# EAGLE design mp3-trigger-v23 (EAGLE 5.11)

## Sheet 1 of 2
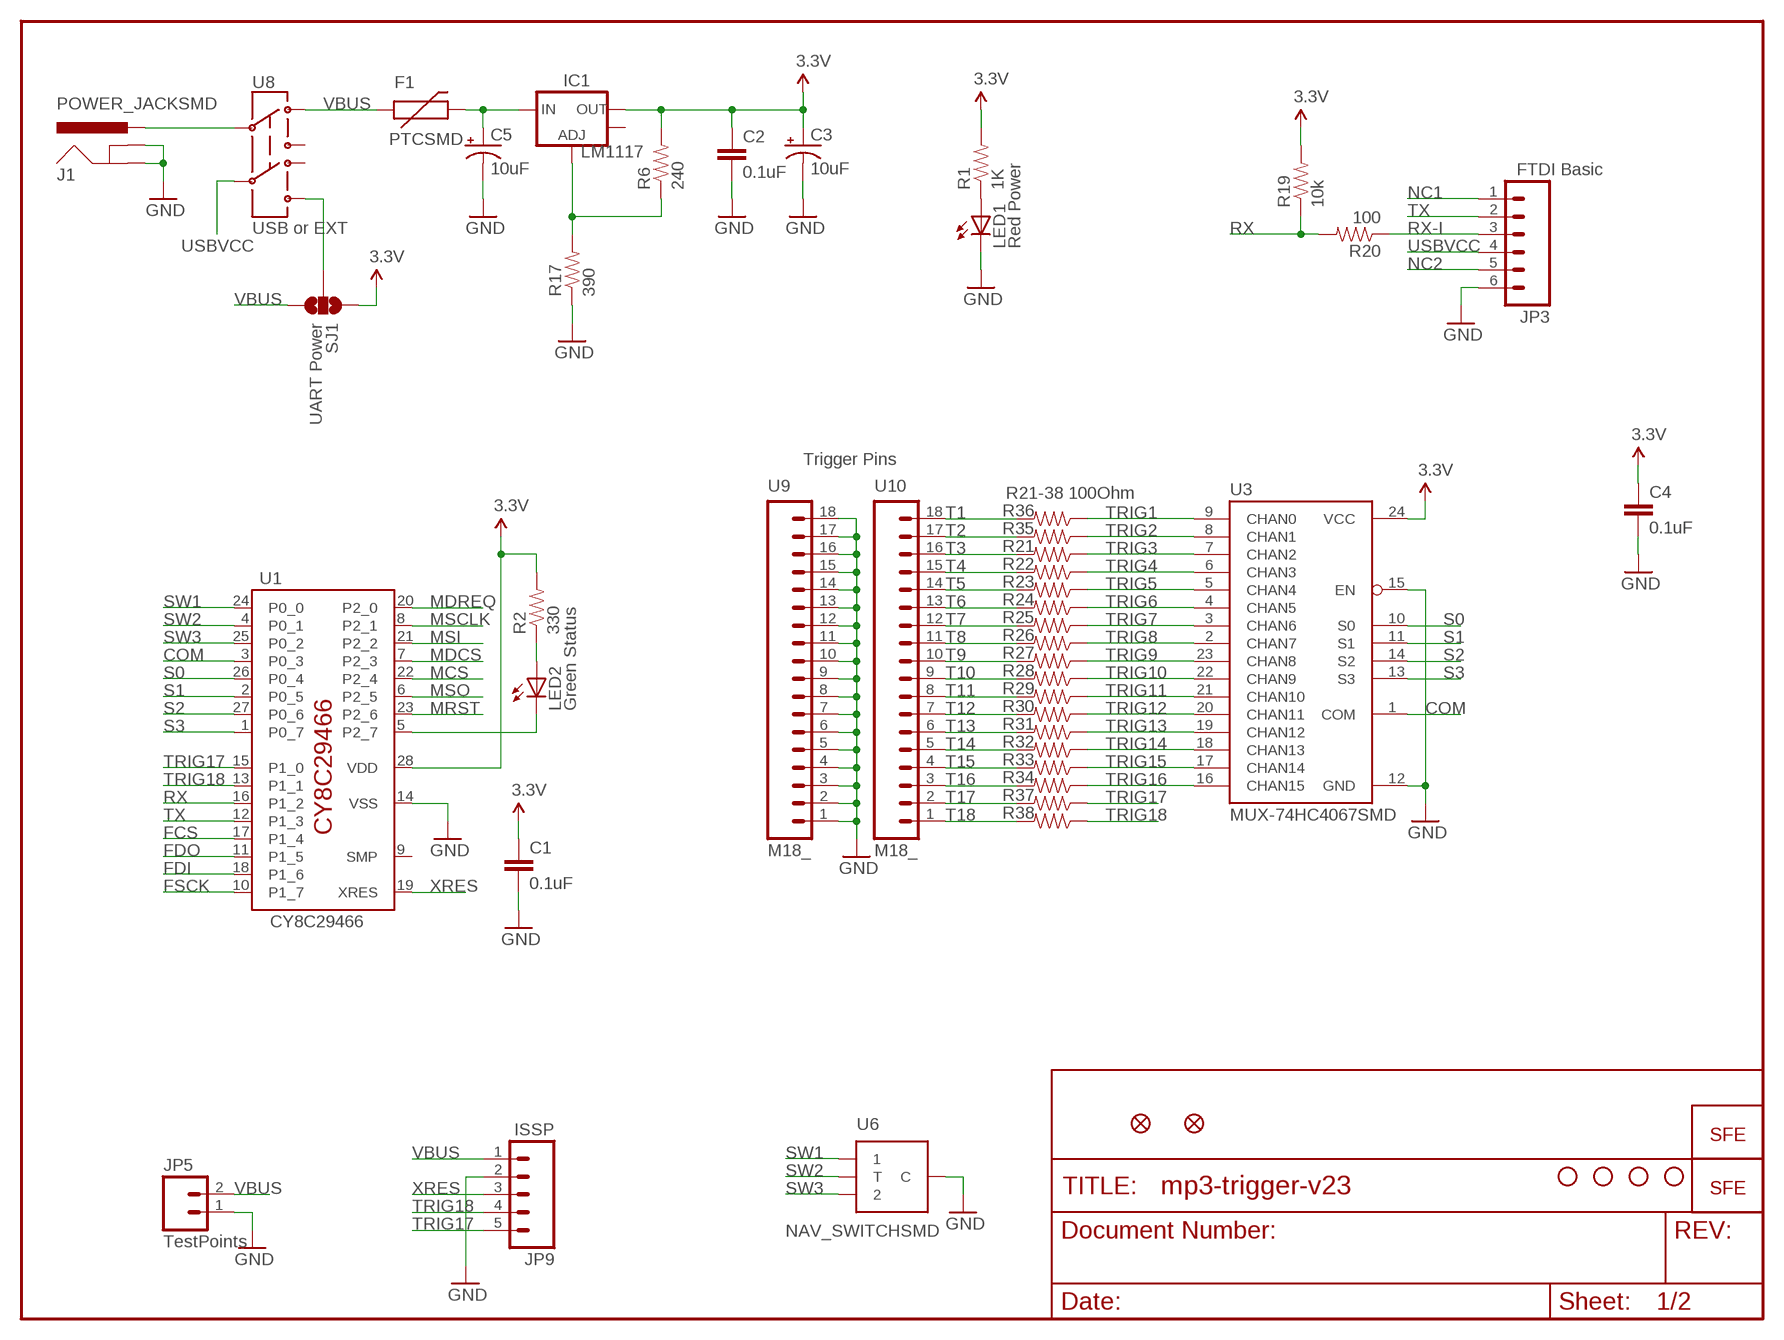
[diagram p0: schematic, sheet 1]

### Parts
C1  0.1uF  CAP0402-CAP  [0402-CAP]
C2  0.1uF  CAP0402-CAP  [0402-CAP]
C3  10uF  CAP_POL1206  [EIA3216]
C4  0.1uF  CAP0402-CAP  [0402-CAP]
C5  10uF  CAP_POL1206  [EIA3216]
F1  PTCSMD  [PTC-1206]
IC1  LM1117  V_REG_LM1117SOT223  [SOT223]
J1  POWER_JACKSMD  [POWER_JACK_SMD]
JP3  FTDI Basic  M06SIP  [1X06]
JP5  TestPoints  M02PTH  [1X02]
JP6  FIDUCIAL1X2  [FIDUCIAL-1X2]
JP7  FIDUCIAL1X2  [FIDUCIAL-1X2]
JP9  ISSP  M05PTH  [1X05]
LED1  Red Power  LED1206  [LED-1206]
LED2  Green Status  LED1206  [LED-1206]
R1  1K  RESISTOR0402-RES  [0402-RES]
R2  330  RESISTOR0402-RES  [0402-RES]
R6  240  RESISTOR0402-RES  [0402-RES]
R17  390  RESISTOR0402-RES  [0402-RES]
R19  10k  RESISTOR0402-RES  [0402-RES]
R20  100  RESISTOR0402-RES  [0402-RES]
R21  100  RESISTOR0402-RES  [0402-RES]
R22  100  RESISTOR0402-RES  [0402-RES]
R23  100  RESISTOR0402-RES  [0402-RES]
R24  100  RESISTOR0402-RES  [0402-RES]
R25  100  RESISTOR0402-RES  [0402-RES]
R26  100  RESISTOR0402-RES  [0402-RES]
R27  100  RESISTOR0402-RES  [0402-RES]
R28  100  RESISTOR0402-RES  [0402-RES]
R29  100  RESISTOR0402-RES  [0402-RES]
R30  100  RESISTOR0402-RES  [0402-RES]
R31  100  RESISTOR0402-RES  [0402-RES]
R32  100  RESISTOR0402-RES  [0402-RES]
R33  100  RESISTOR0402-RES  [0402-RES]
R34  100  RESISTOR0402-RES  [0402-RES]
R35  100  RESISTOR0402-RES  [0402-RES]
R36  100  RESISTOR0402-RES  [0402-RES]
R37  100  RESISTOR0402-RES  [0402-RES]
R38  100  RESISTOR0402-RES  [0402-RES]
SJ1  UART Power  SOLDERJUMPER_2WAYPASTE2&3  [SJ_3_PASTE2&3]
U1  CY8C29466  CY8C29466-24SOIC  [SOIC28]
U3  MUX-74HC4067SMD  [SSOP24]
U6  NAV_SWITCHSMD  [NAV_SWITCH]
U8  USB or EXT  SWITCH-DPDTSMD  [AYZ0202]
U9  M18_  [1X18]
U10  M18_  [1X18]
U$1  LOGO-SFENEW  [SFE-NEW-WEBLOGO]
U$3  LOGO-SFESK  [SFE-LOGO-FLAME]
U$12  STAND-OFF  [STAND-OFF]
U$13  STAND-OFF  [STAND-OFF]
U$14  STAND-OFF  [STAND-OFF]
U$15  STAND-OFF  [STAND-OFF]

### Nets
3.3V: C1.1 C2.1 C3.A(+) C4.1 IC1.2(OUT) R1.2 R2.2 R6.2 R19.2 SJ1.1 U1.28(VDD) U3.24(VCC) ; also sheet 2
COM: U1.3(P0_3) U3.1(COM)
FCS: U1.17(P1_4) ; also sheet 2
FDI: U1.18(P1_6) ; also sheet 2
FDO: U1.11(P1_5) ; also sheet 2
FSCK: U1.10(P1_7) ; also sheet 2
GND: C1.2 C2.2 C3.C(-) C4.2 C5.C(-) J1.GND(GNDBREAK) J1.P$4(GND) JP3.6 JP5.1 JP9.2 LED1.C R17.1 U1.14(VSS) U3.12(GND) U3.15(EN) U6.C U9.1 U9.2 U9.3 U9.4 U9.5 U9.6 U9.7 U9.8 U9.9 U9.10 U9.11 U9.12 U9.13 U9.14 U9.15 U9.16 U9.17 U9.18 ; also sheet 2
MCS: U1.22(P2_4) ; also sheet 2
MDCS: U1.7(P2_3) ; also sheet 2
MDREQ: U1.20(P2_0) ; also sheet 2
MRST: U1.23(P2_6) ; also sheet 2
MSCLK: U1.8(P2_1) ; also sheet 2
MSI: U1.21(P2_2) ; also sheet 2
MSO: U1.6(P2_5) ; also sheet 2
N$2: IC1.1(ADJ) R6.1 R17.2
N$4: LED1.A R1.1
N$9: LED2.A R2.1
N$12: LED2.C U1.5(P2_7)
N$13: J1.VIN0(PWR) U8.2
N$18: C5.A(+) F1.2 IC1.3(IN)
N$20: SJ1.2 U8.6
NC1: JP3.1
NC2: JP3.5
RX: R19.1 R20.2 U1.16(P1_2)
RX-I: JP3.3 R20.1
S0: U1.26(P0_4) U3.10(S0)
S1: U1.2(P0_5) U3.11(S1)
S2: U1.27(P0_6) U3.14(S2)
S3: U1.1(P0_7) U3.13(S3)
SW1: U1.24(P0_0) U6.1
SW2: U1.4(P0_1) U6.T
SW3: U1.25(P0_2) U6.2
T1: R36.2 U10.18
T2: R35.2 U10.17
T3: R21.2 U10.16
T4: R22.2 U10.15
T5: R23.2 U10.14
T6: R24.2 U10.13
T7: R25.2 U10.12
T8: R26.2 U10.11
T9: R27.2 U10.10
T10: R28.2 U10.9
T11: R29.2 U10.8
T12: R30.2 U10.7
T13: R31.2 U10.6
T14: R32.2 U10.5
T15: R33.2 U10.4
T16: R34.2 U10.3
T17: R37.2 U10.2
T18: R38.2 U10.1
TRIG1: R36.1 U3.9(CHAN0)
TRIG2: R35.1 U3.8(CHAN1)
TRIG3: R21.1 U3.7(CHAN2)
TRIG4: R22.1 U3.6(CHAN3)
TRIG5: R23.1 U3.5(CHAN4)
TRIG6: R24.1 U3.4(CHAN5)
TRIG7: R25.1 U3.3(CHAN6)
TRIG8: R26.1 U3.2(CHAN7)
TRIG9: R27.1 U3.23(CHAN8)
TRIG10: R28.1 U3.22(CHAN9)
TRIG11: R29.1 U3.21(CHAN10)
TRIG12: R30.1 U3.20(CHAN11)
TRIG13: R31.1 U3.19(CHAN12)
TRIG14: R32.1 U3.18(CHAN13)
TRIG15: R33.1 U3.17(CHAN14)
TRIG16: R34.1 U3.16(CHAN15)
TRIG17: JP9.5 R37.1 U1.15(P1_0)
TRIG18: JP9.4 R38.1 U1.13(P1_1)
TX: JP3.2 U1.12(P1_3)
USBVCC: JP3.4 U8.5
VBUS: F1.1 JP5.2 JP9.1 SJ1.3 U8.1
XRES: JP9.3 U1.19(XRES)
Unconnected: IC1.4(OUT) U1.9(SMP) U8.3 U8.4

### Notes on the sheet
- Trigger Pins
- R21-38 100Ohm

## Sheet 2 of 2
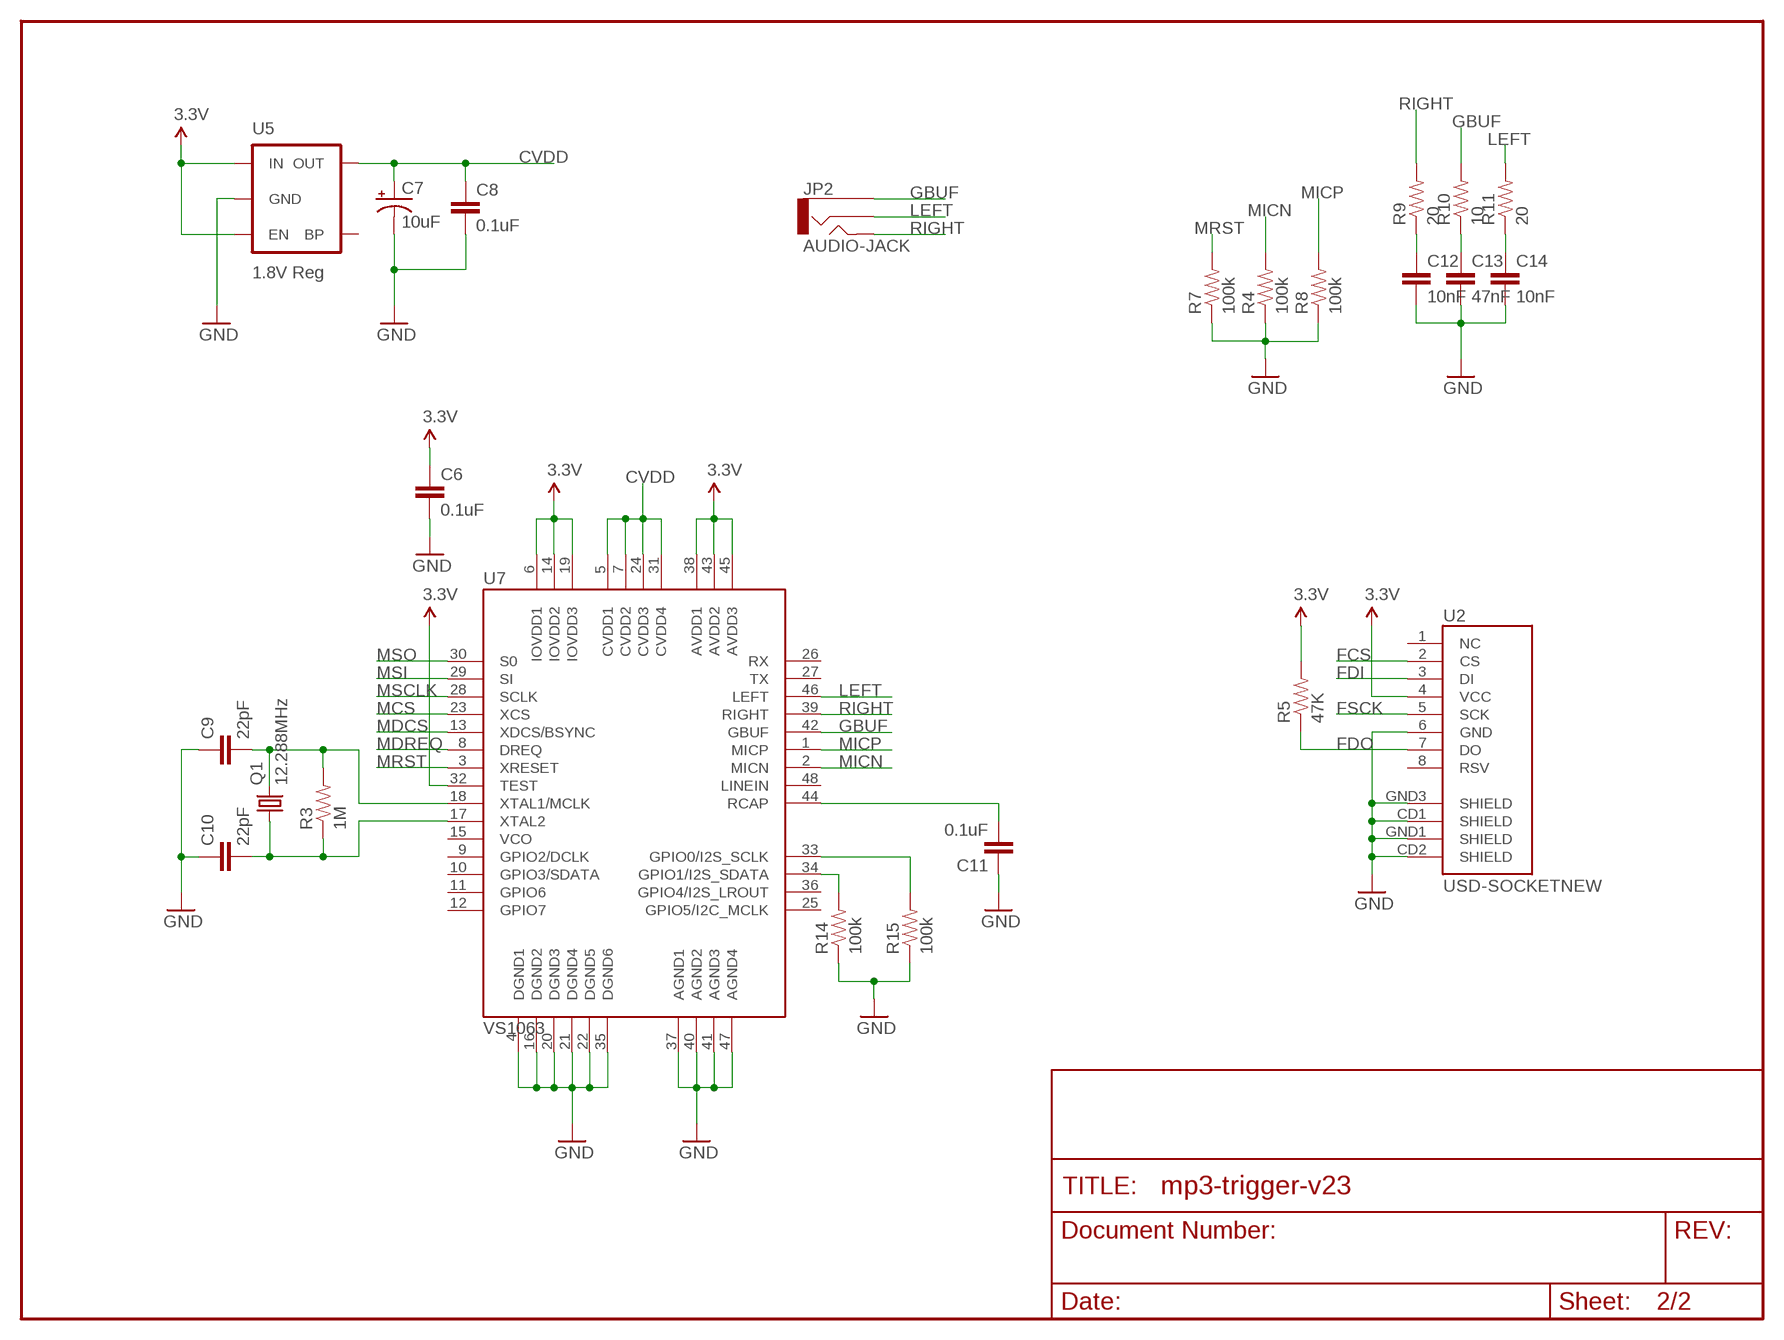
[diagram p1: schematic, sheet 2]

### Parts
C6  0.1uF  CAP0402-CAP  [0402-CAP]
C7  10uF  CAP_POL1206  [EIA3216]
C8  0.1uF  CAP0402-CAP  [0402-CAP]
C9  22pF  CAP0402-CAP  [0402-CAP]
C10  22pF  CAP0402-CAP  [0402-CAP]
C11  0.1uF  CAP0402-CAP  [0402-CAP]
C12  10nF  CAP0402-CAP  [0402-CAP]
C13  47nF  CAP0402-CAP  [0402-CAP]
C14  10nF  CAP0402-CAP  [0402-CAP]
JP2  AUDIO-JACK  AUDIO-JACKPTH  [AUDIO-JACK]
Q1  12.288MHz  CRYSTAL5X3  [CRYSTAL-SMD-5X3]
R3  1M  RESISTOR0402-RES  [0402-RES]
R4  100k  RESISTOR0402-RES  [0402-RES]
R5  47K  RESISTOR0402-RES  [0402-RES]
R7  100k  RESISTOR0402-RES  [0402-RES]
R8  100k  RESISTOR0402-RES  [0402-RES]
R9  20  RESISTOR0402-RES  [0402-RES]
R10  10  RESISTOR0402-RES  [0402-RES]
R11  20  RESISTOR0402-RES  [0402-RES]
R14  100k  RESISTOR0402-RES  [0402-RES]
R15  100k  RESISTOR0402-RES  [0402-RES]
U2  USD-SOCKETNEW  [MICRO-SD-SOCKET-PP]
U5  1.8V Reg  V_REG_LDOSMD2  [SC70]
U7  VS1063  VS1033  [LQFP-48]

### Nets
3.3V: C6.1 R5.2 U2.4(VCC) U5.1(IN) U5.3(EN) U7.6(IOVDD1) U7.14(IOVDD2) U7.19(IOVDD3) U7.32(TEST) U7.38(AVDD1) U7.43(AVDD2) U7.45(AVDD3) ; also sheet 1
CVDD: C7.A(+) C8.1 U5.5(OUT) U7.5(CVDD1) U7.7(CVDD2) U7.24(CVDD3) U7.31(CVDD4)
FCS: U2.2(CS) ; also sheet 1
FDI: U2.3(DI) ; also sheet 1
FDO: R5.1 U2.7(DO) ; also sheet 1
FSCK: U2.5(SCK) ; also sheet 1
GBUF: JP2.1 R10.2 U7.42(GBUF)
GND: C6.2 C7.C(-) C8.2 C9.1 C10.1 C11.1 C12.2 C13.2 C14.2 R4.1 R7.1 R8.1 R14.1 R15.1 U2.6(GND) U2.CD1(SHIELD) U2.CD2(SHIELD) U2.GND1(SHIELD) U2.GND3(SHIELD) U5.2(GND) U7.4(DGND1) U7.16(DGND2) U7.20(DGND3) U7.21(DGND4) U7.22(DGND5) U7.35(DGND6) U7.37(AGND1) U7.40(AGND2) U7.41(AGND3) U7.47(AGND4) ; also sheet 1
LEFT: JP2.2 R11.2 U7.46(LEFT)
MCS: U7.23(XCS) ; also sheet 1
MDCS: U7.13(XDCS/BSYNC) ; also sheet 1
MDREQ: U7.8(DREQ) ; also sheet 1
MICN: R4.2 U7.2(MICN)
MICP: R8.2 U7.1(MICP)
MRST: R7.2 U7.3(XRESET) ; also sheet 1
MSCLK: U7.28(SCLK) ; also sheet 1
MSI: U7.29(SI) ; also sheet 1
MSO: U7.30(S0) ; also sheet 1
N$3: C9.2 Q1.3 R3.2 U7.18(XTAL1/MCLK)
N$5: C10.2 Q1.1 R3.1 U7.17(XTAL2)
N$10: R14.2 U7.34(GPIO1/I2S_SDATA)
N$11: C11.2 U7.44(RCAP)
N$14: C14.1 R11.1
N$15: C13.1 R10.1
N$16: C12.1 R9.1
N$17: R15.2 U7.33(GPIO0/I2S_SCLK)
RIGHT: JP2.5 R9.2 U7.39(RIGHT)
Unconnected: U2.1(NC) U2.8(RSV) U5.4(BP) U7.9(GPIO2/DCLK) U7.10(GPIO3/SDATA) U7.11(GPIO6) U7.12(GPIO7) U7.15(VCO) U7.25(GPIO5/I2C_MCLK) U7.26(RX) U7.27(TX) U7.36(GPIO4/I2S_LROUT) U7.48(LINEIN)

## Library data of the parts
C1 C2 C4 C6 C8-C14 = SparkFun:CAP: Capacitor Standard 0603 ceramic capacitor, and 0.1" leaded capacitor.
C3 C5 C7 = SparkFun:CAP_POL: Capacitor Polarized These are standard SMD and PTH capacitors. Normally 10uF, 47uF, and 100uF in electrolytic and tantalum varieties. Always verify the external diameter of the through hole cap, it varies with capacity, voltage, and manufacturer. The EIA devices should be standard.
F1 = SparkFun:PTC: Resettable Fuse PTC Resettable Fuse. Spark Fun Electronics SKU : COM-08357
IC1 = SparkFun:V_REG_LM1117: Voltage Regulator LM1117 Standard adjustable voltage regulator but in SMD form. Spark Fun Electronics SKU : COM-00595
J1 = SparkFun:POWER_JACK: Power Jack This is the standard 5.5mm barrel jack for power. The PTH is the most common, proven, reliable, footprint. All others are experimental. The Slot footprint only works if the mill layer is transmitted to the PCB fab house so be warned. Spark Fun Electronics SKU : PRT-00119. Mating wall wart : TOL-00298 (and others)
JP2 = SparkFun:AUDIO-JACK: 3.5mm Audio Jack Simple 3.5mm common PCB mount audio jack. SKU: PRT-08032
JP3 = SparkFun:M06: Header 6 Standard 6-pin 0.1" header. Use with straight break away headers (SKU : PRT-00116), right angle break away headers (PRT-00553), swiss pins (PRT-00743), machine pins (PRT-00117), and female headers (PRT-00115). Molex polarized connector foot print use with SKU : PRT-08094 with associated crimp pins and housings. NOTES ON THE VARIANTS LOCK and LOCK_LONGPADS... This footprint was designed to help hold the alignment of a through-hole component (i.e. 6-pin header) while soldering it into place. You may notice that each hole has been shifted either up or down by 0.005 of an inch from it's more standard position (which is a perfectly straight line). This slight alteration caused the pins (the squares in the middle) to touch the edges of the holes. Because they are alternating, it causes a "brace" to hold the component in place. 0.005 has proven to be the perfect amount of "off-center" position when using our standard breakaway headers. Although looks a little odd when you look at the bare footprint, once you have a header in there, the alteration is very hard to notice. Also, if you push a header all the way into place, it is covered up entirely on the bottom side. This idea of altering the position of holes to aid alignment will be further integrated into the Sparkfun Library for other footprints. It can help hold any component with 3 or more connection pins.
JP5 = SparkFun:M02: Header 2 Standard 2-pin 0.1" header. Use with straight break away headers (SKU : PRT-00116), right angle break away headers (PRT-00553), swiss pins (PRT-00743), machine pins (PRT-00117), and female headers (PRT-00115). Molex polarized connector foot print use with SKU : PRT-08233 with associated crimp pins and housings.
JP6 JP7 = SparkFun:FIDUCIAL: Fiducial Alignment Points Various fiducial points for machine vision alignment.
JP9 = SparkFun:M05: Header 5 Standard 5-pin 0.1" header. Use with straight break away headers (SKU : PRT-00116), right angle break away headers (PRT-00553), swiss pins (PRT-00743), machine pins (PRT-00117), and female headers (PRT-00115). Molex polarized connector foot print use with SKU : PRT-08230 with associated crimp pins and housings.
LED1 LED2 = SparkFun:LED: LEDs Standard schematic elements and footprints for 5mm, 3mm, 1206, and 0603 sized LEDs. 5mm - Spark Fun Electronics SKU : COM-00529 (and others)
Q1 = SparkFun:CRYSTAL: Crystals Various standard crystals. Proven footprints. Spark Fun Electronics SKU : COM-00534
R1-R11 R14 R15 R17 R19-R38 = SparkFun:RESISTOR: Resistor Basic schematic elements and footprints for 0603, 1206, and PTH 1/10th watt (small) resistors.
SJ1 = SparkFun:SOLDERJUMPER_2WAY: Solder Jumper 2 way solder jumper
U1 = cypress-psoc:CY8C29466-24*
U2 = SparkFun:USD-SOCKET: microSD Socket Push-push type uSD socket. Schematic element and footprint production proven. Spark Fun Electronics SKU : PRT-00127. tDoc lines correctly indicate media card edge positions when inserting (unlocked, locked, depressed).
U3 = SparkFun:MUX-74HC4067
U5 = SparkFun:V_REG_LDO: Voltage Regulator LDO Standard 150mA LDO voltage regulator in SOT-23 layout. Micrel part MIC5205. BP (by-pass) pin is used to lower output noise with 470pF cap.
U6 = SparkFun:NAV_SWITCH: Navigation Switch Three way navigation switch. Commonly used as up/down/select on MP3 players. Schematic element and footprint production proven. Spark Fun Electronics SKU : COM-08184
U7 = SparkFun:VS1033
U8 = SparkFun:SWITCH-DPDT: DPDT Version of the COM-00597
U9 U10 = SparkFun:M18
U$1 U$3 = SparkFun:LOGO-SFE: Spark Fun Electronics PCB Logo This is the standard Spark Fun Electronics PCB logo.
U$12-U$15 = SparkFun:STAND-OFF: Stand Off This is the mechanical footprint for a #4 phillips button head screw. Use the keepout ring to avoid running the screw head into surrounding components. SKU : PRT-00447

## Net classes
1 +5v: width 0.813 mm
2 GND: width 0.813 mm

## Board
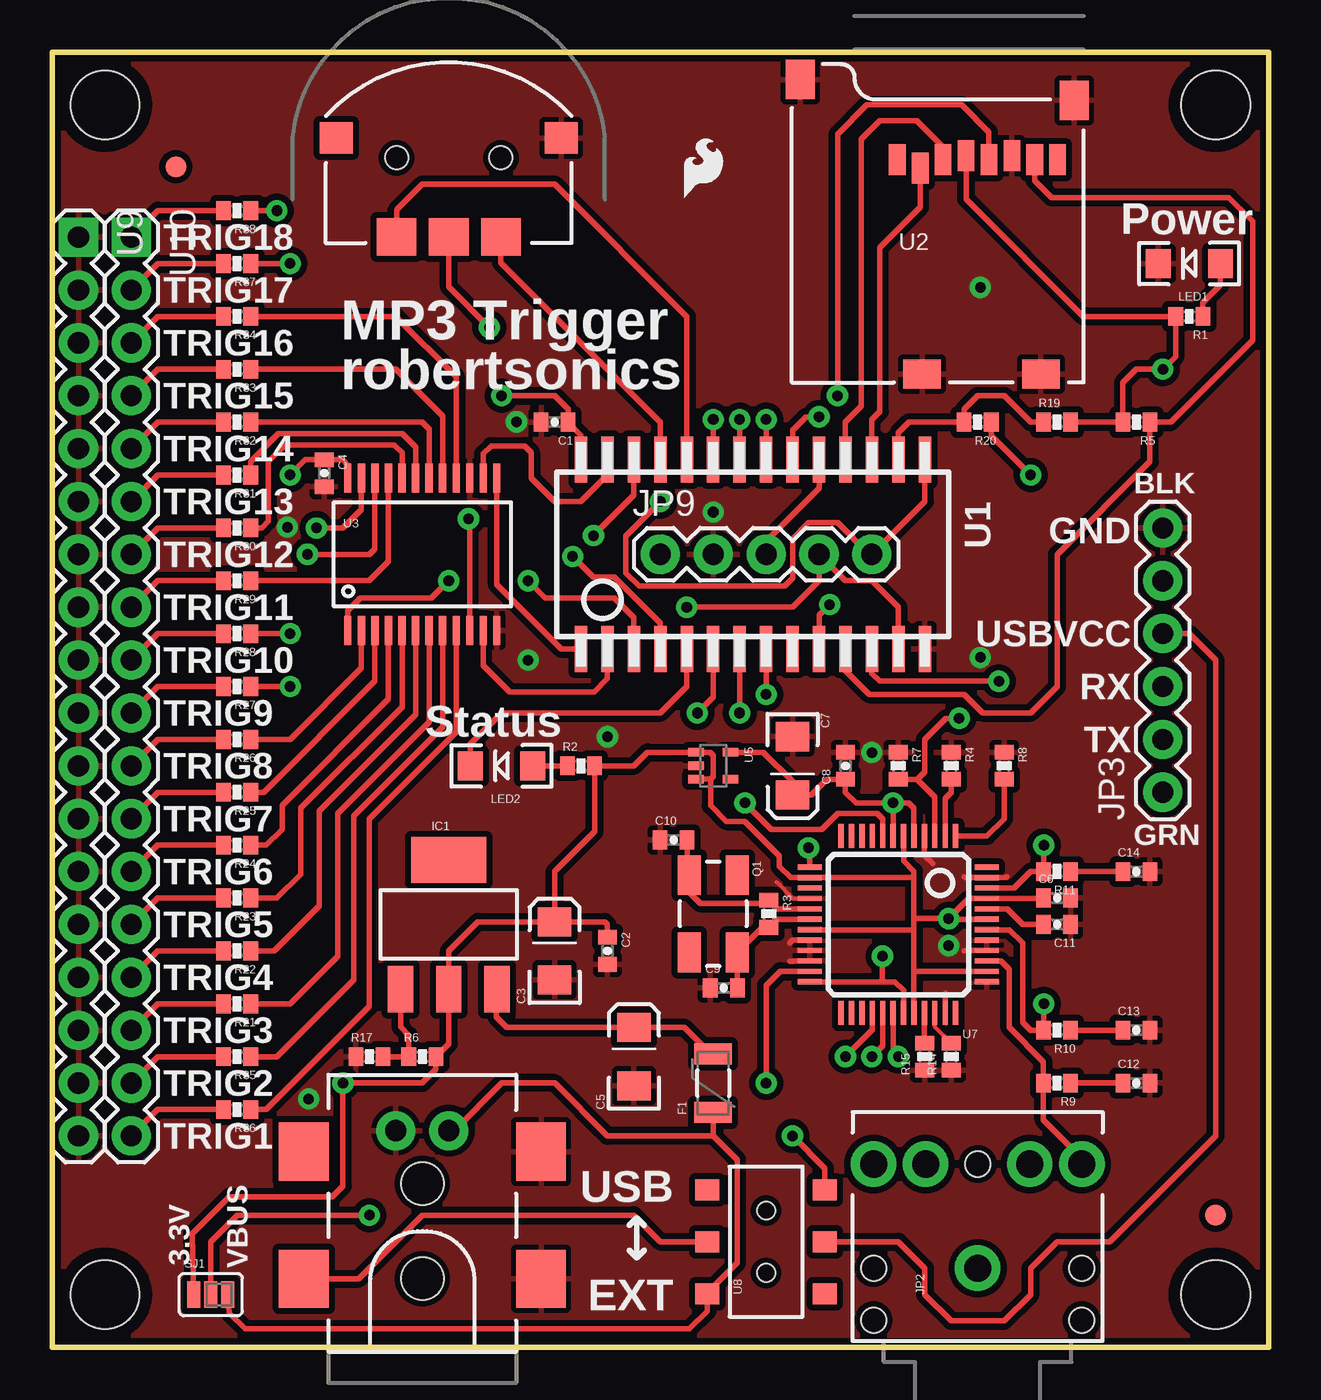
[diagram p2: board, top side]
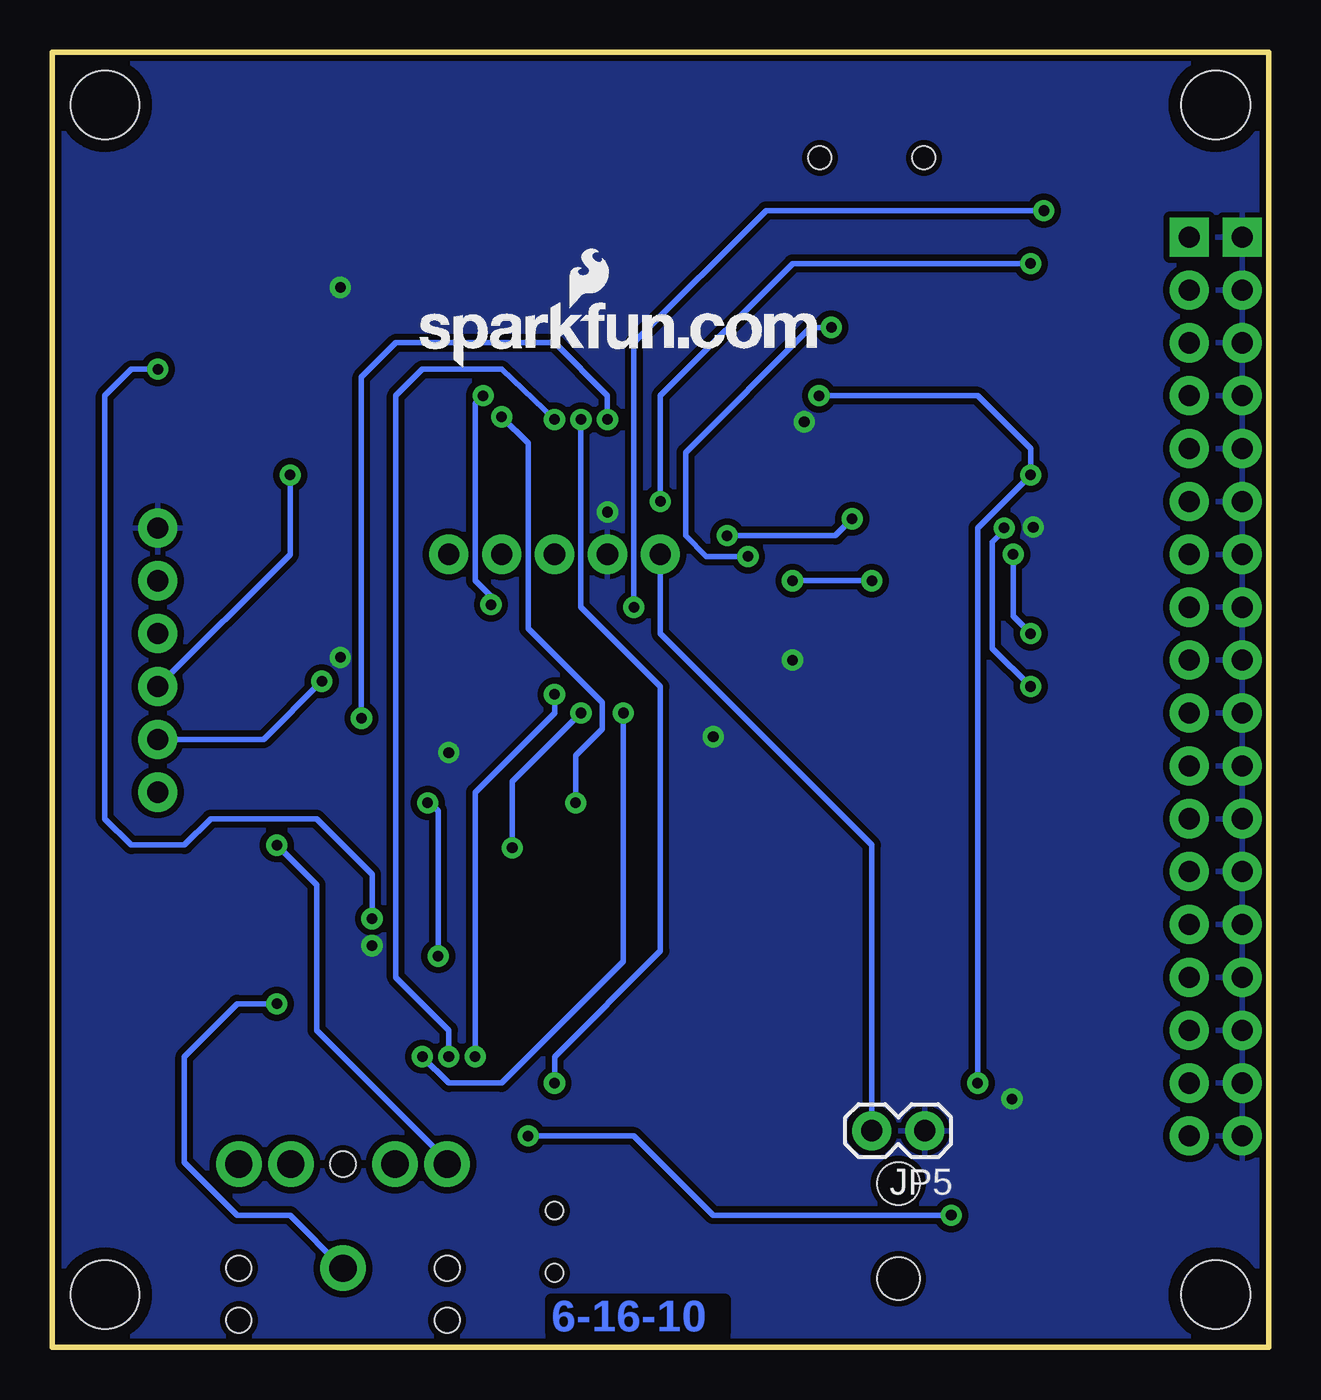
[diagram p3: board, bottom side, seen from below]

Size 58.42 x 62.23 mm. Coordinates in mm from the lower left corner, seen from the top.
Outline: 0,0 0,62.23 58.42,62.23 58.42,0 0,0
Copper layers (1*16): Top 0.035mm / dielectric 1.5mm / Bottom 0.035mm
Design rules "SparkFun": minimum track width 8mil, minimum drill 20mil, track to track 8mil, track to pad 8mil, pad to pad 8mil, via to via 8mil, smd to smd 8mil, copper to edge 8mil, drill to drill 8mil, minimum pad ring 12mil, minimum via ring 10mil, stop-mask expansion 4mil, vias tented up to drill 20mil, thermal gap 10mil

### Footprints (pad centres in the part's own frame; a part is rotated, then mirrored left to right if it is on the bottom)
0402-CAP = smd 0.7 x 0.9: 1 -0.65,0; 2 0.65,0
EIA3216 = smd 1.4 x 1.6: A 1.4,0; C -1.4,0
PTC-1206 = smd 1 x 1.8: 1 -1.4,0; 2 1.4,0
SOT223 = smd 1.219 x 2.235: 1 -2.311,-3.099; 2 0,-3.099; 3 2.311,-3.099 | smd 3.6 x 2.2: 4 0,3.099
POWER_JACK_SMD = smd 2.8 x 2.4: GND 0,-5.7; P$4 6.1,-5.7; VIN0 0,5.7; VIN1 6.1,5.7 | hole 2.032: 0,0; 4.572,0
AUDIO-JACK = drill 1.3 pad 2.184 round: 1 0,0; 2 5,5; 3 5,2.5; 4 5,-2.5; 5 5,-5 | hole 1.2: 0,5; -2.5,5; -2.5,-5; 0,-5; 5,0
1X06 = drill 1.016 pad 1.88 round: 1 0,0; 2 2.54,0; 3 5.08,0; 4 7.62,0; 5 10.16,0; 6 12.7,0
1X02 = drill 1.016 pad 1.88 round: 1 0,0; 2 2.54,0
FIDUCIAL-1X2 = smd 1 x 1: 1 0,0
1X05 = drill 1.016 pad 1.88 round: 1 0,0; 2 2.54,0; 3 5.08,0; 4 7.62,0; 5 10.16,0
LED-1206 = smd 1.2 x 1.4: A -1.5,0; C 1.5,0
CRYSTAL-SMD-5X3 = smd 1.9 x 1.1: 1 -1.85,-1.15; 2 1.85,-1.15; 3 1.85,1.15; 4 -1.85,1.15
0402-RES = smd 0.7 x 0.9: 1 -0.65,0; 2 0.65,0
SJ_3_PASTE2&3 = smd 0.635 x 1.27: 1 -0.813,0; 2 0,0; 3 0.813,0
SOIC28 = smd 0.6 x 2.2: 1 8.89,4.548; 2 7.62,4.548; 3 6.35,4.548; 4 5.08,4.548; 5 3.81,4.548; 6 2.54,4.548; 7 1.27,4.548; 8 0,4.548; 9 -1.27,4.548; 10 -2.54,4.548; 11 -3.81,4.548; 12 -5.08,4.548; 13 -6.35,4.548; 14 -7.62,4.548; 15 -7.62,-4.548; 16 -6.35,-4.548; 17 -5.08,-4.548; 18 -3.81,-4.548; 19 -2.54,-4.548; 20 -1.27,-4.548; 21 0,-4.548; 22 1.27,-4.548; 23 2.54,-4.548; 24 3.81,-4.548; 25 5.08,-4.548; 26 6.35,-4.548; 27 7.62,-4.548; 28 8.89,-4.548
MICRO-SD-SOCKET-PP = smd 0.8 x 1.5: 1 -8.94,10.7; 2 -7.84,10.3; 3 -6.74,10.7; 4 -5.64,10.9; 5 -4.54,10.7; 6 -3.44,10.9; 7 -2.34,10.7; 8 -1.24,10.7 | smd 1.8 x 1.4: CD1 -2.05,0.4; CD2 -7.75,0.4 | smd 1.4 x 1.9: GND1 -13.6,14.55; GND3 -0.45,13.55
SSOP24 = smd 0.348 x 1.397: 1 -3.575,-3.656; 2 -2.925,-3.656; 3 -2.275,-3.656; 4 -1.625,-3.656; 5 -0.975,-3.656; 6 -0.325,-3.656; 7 0.325,-3.656; 8 0.975,-3.656; 9 1.625,-3.656; 10 2.275,-3.656; 11 2.925,-3.656; 12 3.575,-3.656; 13 3.575,3.656; 14 2.925,3.656; 15 2.275,3.656; 16 1.625,3.656; 17 0.975,3.656; 18 0.325,3.656; 19 -0.325,3.656; 20 -0.975,3.656; 21 -1.625,3.656; 22 -2.275,3.656; 23 -2.925,3.656; 24 -3.575,3.656
SC70 = smd 0.4 x 0.75: 1 -0.65,-0.825; 2 0,-0.825; 3 0.65,-0.825; 4 0.65,0.825; 5 -0.65,0.825
NAV_SWITCH = smd 1.9 x 1.8: 1 -2.5,-3.8; 2 2.5,-3.8; T 0,-3.8 | smd 1.6 x 1.5: C 5.4,0.95; NC -5.4,0.95 | hole 1.1: -2.5,0; 2.5,0
LQFP-48 = smd 0.254 x 1.143: 1 -2.75,-4.25; 2 -2.25,-4.25; 3 -1.75,-4.25; 4 -1.25,-4.25; 5 -0.75,-4.25; 6 -0.25,-4.25; 7 0.25,-4.25; 8 0.75,-4.25; 9 1.25,-4.25; 10 1.75,-4.25; 11 2.25,-4.25; 12 2.75,-4.25; 25 2.75,4.25; 26 2.25,4.25; 27 1.75,4.25; 28 1.25,4.25; 29 0.75,4.25; 30 0.25,4.25; 31 -0.25,4.25; 32 -0.75,4.25; 33 -1.25,4.25; 34 -1.75,4.25; 35 -2.25,4.25; 36 -2.75,4.25 | smd 1.143 x 0.254: 13 4.25,-2.75; 14 4.25,-2.25; 15 4.25,-1.75; 16 4.25,-1.25; 17 4.25,-0.75; 18 4.25,-0.25; 19 4.25,0.25; 20 4.25,0.75; 21 4.25,1.25; 22 4.25,1.75; 23 4.25,2.25; 24 4.25,2.75; 37 -4.25,2.75; 38 -4.25,2.25; 39 -4.25,1.75; 40 -4.25,1.25; 41 -4.25,0.75; 42 -4.25,0.25; 43 -4.25,-0.25; 44 -4.25,-0.75; 45 -4.25,-1.25; 46 -4.25,-1.75; 47 -4.25,-2.25; 48 -4.25,-2.75
AYZ0202 = smd 1 x 1.15: 1 -2.5,2.825; 2 0,2.825; 3 2.5,2.825; 4 -2.5,-2.825; 5 0,-2.825; 6 2.5,-2.825 | hole 0.85: 1.5,0; -1.5,0
1X18 = drill 1.016 pad 1.88 square: 1 0,0 | drill 1.016 pad 1.88 round: 2 2.54,0; 3 5.08,0; 4 7.62,0; 5 10.16,0; 6 12.7,0; 7 15.24,0; 8 17.78,0; 9 20.32,0; 10 22.86,0; 11 25.4,0; 12 27.94,0; 13 30.48,0; 14 33.02,0; 15 35.56,0; 16 38.1,0; 17 40.64,0; 18 43.18,0
STAND-OFF = hole 3.302: 0,0

### Placement (x,y rotation side)
C1  24.13,44.45 180 top
C2  26.67,19.05 270 top
C3  24.13,19.05 90 top
C4  13.07,42 270 top
C5  27.94,13.97 90 top
C6  48.26,21.59 0 top
C7  35.56,27.94 270 top
C8  38.1,27.94 90 top
C9  32.26,17.27 0 top
C10  29.84,24.38 0 top
C11  48.26,20.32 180 top
C12  52.07,12.7 0 top
C13  52.07,15.24 0 top
C14  52.07,22.86 0 top
F1  31.75,12.7 90 top
IC1  19.05,20.32 0 top
J1  17.78,3.3 90 top
JP2  44.45,3.81 90 top
JP3  53.34,26.67 90 top
JP5  16.51,10.41 180 bottom
JP6  5.94,56.72 0 top
JP7  55.88,6.35 0 top
JP9  29.21,38.1 0 top
LED1  54.61,52.07 180 top
LED2  21.59,27.94 180 top
Q1  31.75,20.83 270 top
R1  54.61,49.53 180 top
R2  25.4,27.94 0 top
R3  34.42,20.83 270 top
R4  43.18,27.94 270 top
R5  52.07,44.45 180 top
R6  17.78,13.97 0 top
R7  40.64,27.94 270 top
R8  45.72,27.94 270 top
R9  48.26,12.7 180 top
R10  48.26,15.24 180 top
R11  48.26,22.86 180 top
R14  43.18,13.97 90 top
R15  41.91,13.97 90 top
R17  15.24,13.97 0 top
R19  48.26,44.45 0 top
R20  44.45,44.45 180 top
R21  8.89,16.51 180 top
R22  8.89,19.05 180 top
R23  8.89,21.59 180 top
R24  8.89,24.13 180 top
R25  8.89,26.67 180 top
R26  8.89,29.21 180 top
R27  8.89,31.75 180 top
R28  8.89,34.29 180 top
R29  8.89,36.83 180 top
R30  8.89,39.37 180 top
R31  8.89,41.91 180 top
R32  8.89,44.45 180 top
R33  8.89,46.99 180 top
R34  8.89,49.53 180 top
R35  8.89,13.97 180 top
R36  8.89,11.43 180 top
R37  8.89,52.07 180 top
R38  8.89,54.61 180 top
SJ1  7.62,2.54 0 top
U1  34.29,38.1 180 top
U2  49.53,46.35 0 top
U3  17.78,38.1 0 top
U5  31.75,27.94 270 top
U6  19.05,57.15 0 top
U7  40.64,20.32 180 top
U8  34.29,5.08 90 top
U9  1.27,53.34 270 top
U10  3.81,53.34 270 top
U$1  40.77,47.07 0 bottom
U$3  30.35,55.24 0 top
U$12  55.88,2.54 0 top
U$13  2.54,2.54 0 top
U$14  2.54,59.69 0 top
U$15  55.88,59.69 0 top

### Tracks (layer width: path | path; a pad name or v marks a point on that pad's centre or on a via)
3.3V  (via drill 0.51)
  Top 0.254: C3.A 20.45,20.45 19.05,19.05 IC1.2 19.05,14.59 R6.2 18.43,13.35 17.78,12.7 v13.97,12.7 13.97,7.75 13.46,7.24 8.51,7.24 6.73,5.46 SJ1.1 | C3.A 26.54,20.45 26.67,20.32 C2.1 | 31.62,27.3 31.75,27.43 31.75,28.45 31.61,28.59 U5.1 28.59,28.59 27.94,27.94 R2.2 26.05,24.78 24.13,22.86 C3.A | 31.62,27.3 30.94,27.3 U5.3 | 41.39,18.03 U7.32 | 41.39,20.57 41.39,20.27 | 41.39,20.27 41.39,18.03 | 41.39,22.48 41.39,20.57 | 41.39,22.48 41.39,22.87 40.89,23.37 U7.6 | 41.39,20.57 | U7.38 41.43,18.07 41.39,18.03 | 41.39,22.48 41.3,22.57 U7.14 35.47,22.57 34.92,23.11 34.92,23.62 33.27,25.27 32.38,25.27 31.62,26.04 31.62,27.3 | U7.19 41.39,20.07 41.39,20.27 | C6.1 47.59,21.57 U7.45 44.02,21.57 v43.05,20.6 | R19.2 R5.2 51.42,46.34 52.07,46.99 v53.34,46.99 53.96,47.61 R1.2 49.53,49.53 43.89,55.17 U2.4 | U1.28 25.4,43.83 C1.1 24.78,45.07 24.13,45.72 v21.59,45.72 | v11.43,41.91 12.17,42.65 C4.1 13.95,42.65 14.21,42.4 U3.24 | U7.43 43.08,20.57 v43.05,20.6 | v43.05,20.6 41.41,20.6 41.39,20.57
  Bottom 0.254: v21.59,45.72 13.97,45.72 11.43,43.18 v11.43,41.91 13.97,39.37 v13.97,12.7 | v43.05,20.6 43.05,22.73 45.72,25.4 50.8,25.4 52.07,24.13 54.61,24.13 55.88,25.4 55.88,45.72 54.61,46.99 v53.34,46.99
COM  (via drill 0.51)
  Top 0.254: U1.3 27.94,35.06 27,36 23.69,36 v22.86,36.83 | U3.1 14.21,35.41 14.8,36 18.22,36 v19.05,36.83
  Bottom 0.254: v19.05,36.83 v22.86,36.83
CVDD  (via drill 0.51)
  Top 0.254: U5.5 34.15,28.59 35.56,27.18 C7.A 36.45,26.54 37.2,27.29 C8.1 38.1,26.67 38.61,26.16 v40.39,26.16 | U7.24 39.88,17.57 | 39.88,17.57 40.47,17.57 40.89,17.14 U7.31 | 39.88,17.57 v39.88,18.8 | U7.7 v40.39,26.16 | U7.5 41.39,25.92 41.15,26.16 v40.39,26.16
  Bottom 0.254: v39.88,18.8 39.88,25.78 40.26,26.16 v40.39,26.16
FCS
  Top 0.254: U1.17 39.37,44.58 39.75,44.96 39.75,52.83 41.69,54.77 U2.2
FDI
  Top 0.254: U2.3 42.79,57.67 41.53,58.93 39.75,58.93 38.86,58.04 38.86,45.21 38.1,44.45 U1.18
FDO
  Top 0.254: U2.7 47.19,56.06 48.01,55.24 56.52,55.24 57.66,54.1 57.66,48.39 53.72,44.45 R5.1 52.72,42.56 48.26,38.1 48.26,31.75 46.99,30.48 44.7,30.48 43.81,31.37 39.24,31.37 38.1,32.51 U1.11
FSCK  (via drill 0.51)
  Top 0.254: U1.10 36.83,35.18 v37.34,35.69 | U2.5 44.99,58.39 43.69,59.69 39.12,59.69 37.72,58.29 v37.72,45.72
  Bottom 0.254: v37.34,35.69 37.34,36.07 38.1,36.83 38.1,45.34 v37.72,45.72
GBUF  (via drill 0.51)
  Top 0.254: U7.42 45.97,20.07 46.61,19.43 46.61,15.62 46.99,15.24 R10.2 47.62,15.26 v47.62,16.51
  Bottom 0.254: JP2.1 46.99,6.35 49.53,6.35 52.07,8.89 52.07,13.97 49.53,16.51 v47.62,16.51
GND  (via drill 0.51)
  Top 0.203: U7.16 35.58,21.57 34.8,22.35
  Top 0.254: U7.22 35.59,18.57 35.56,18.54 35.43,18.54 | U7.20 35.57,19.57 35.43,19.43 | 45.85,22.61 45.81,22.57 U7.47 43.85,22.57 43.81,22.61 | U7.35 42.89,16.98 42.93,17.02 | U7.40 44.09,19.07 44.07,19.05 43.81,19.05 | U7.4 41.89,23.64 42.29,23.24
  other vias: 43.05,19.3 39.37,28.57 44.58,33.15 44.58,50.93 22.86,33.02 31.75,40.13 22.3,44.46 11.3,39.41 12.32,11.94 26.67,29.34
  pour Bottom (isolate 0.305): 0,62.23 58.42,62.23 58.42,0 0,0
  pour Top (isolate 0.305): 0,62.23 58.42,62.23 58.42,0 0,0
LEFT  (via drill 0.51)
  Top 0.254: v47.62,24.13 47.62,22.88 R11.2 46.99,22.86 46.2,22.07 U7.46
  Bottom 0.254: JP2.2 39.45,8.97 45.72,15.24 45.72,22.23 v47.62,24.13
MCS  (via drill 0.51)
  Top 0.254: v33.02,44.58 U1.22 | U7.23 34.96,18.07 34.29,17.4 v34.29,12.7
  Bottom 0.254: v34.29,12.7 34.29,13.97 29.21,19.05 29.21,31.75 33.02,35.56 v33.02,44.58
MDCS  (via drill 0.51)
  Top 0.254: v33.02,30.48 U1.7 | U7.13 36.39,23.93 v36.32,24
  Bottom 0.254: v36.32,24 36.32,27.18 v33.02,30.48
MDREQ  (via drill 0.51)
  Top 0.254: U7.8 39.89,25.39 39.62,25.65 37.72,25.65 36.96,24.89 34.54,24.89 v33.27,26.16 | U1.20 35.56,44.07 36.2,44.7 v36.83,44.7
  Bottom 0.254: v33.27,26.16 33.27,28.45 32,29.72 32,30.99 35.56,34.54 35.56,43.43 v36.83,44.7
MICN
  Top 0.254: U7.2 42.89,26.38 43.18,26.67 R4.2
MICP
  Top 0.254: U7.1 44.89,24.57 45.72,25.4 R8.2
MRST  (via drill 0.51)
  Top 0.254: U7.3 42.39,26.44 41.54,27.29 | 41.54,27.29 R7.2 | v31.75,44.58 U1.23 | v43.56,30.23 42.93,30.23 41.91,29.21 41.91,27.66 41.54,27.29
  Bottom 0.254: v31.75,44.58 31.75,45.72 34.29,48.26 41.91,48.26 43.56,46.61 v43.56,30.23
MSCLK  (via drill 0.51)
  Top 0.254: U7.28 39.39,15.26 v38.1,13.97 | v34.29,31.37 U1.8
  Bottom 0.254: v34.29,31.37 34.29,30.48 38.1,26.67 v38.1,13.97
MSI  (via drill 0.51)
  Top 0.254: U7.29 39.89,14.49 v39.37,13.97 | v34.29,44.58 U1.21
  Bottom 0.254: v39.37,13.97 39.37,15.24 41.91,17.78 41.91,45.72 40.64,46.99 36.83,46.99 v34.29,44.58
MSO  (via drill 0.51)
  Top 0.254: U7.30 40.39,14.22 v40.64,13.97 | U1.6 31.75,31.24 v30.99,30.48
  Bottom 0.254: v40.64,13.97 39.37,12.7 36.83,12.7 30.99,18.54 v30.99,30.48
N$2
  Top 0.254: R17.2 R6.1 17.13,15 16.74,15.39 IC1.1
N$3
  Top 0.254: C9.2 Q1.3 34.1,20.18 R3.2 34.81,20.57 U7.18
N$4
  Top 0.254: R1.1 55.26,50.18 56.11,51.03 LED1.A
N$5
  Top 0.254: C10.2 30.5,22.78 Q1.1 30.6,21.85 31.11,21.34 34.27,21.34 R3.1 34.83,21.07 U7.17
N$9
  Top 0.254: R2.1 LED2.A
N$10
  Top 0.203: U7.34 42.39,15.41 R14.2
N$11
  Top 0.254: C11.2 46.61,20.32 45.86,21.07 U7.44
N$12
  Top 0.254: U1.5 30.48,31.75 29.21,30.48 21.59,30.48 20.09,28.98 LED2.C
N$13
  Top 0.254: U8.2 29.21,5.08 27.94,6.35 17.78,6.35 14.73,3.3 J1.VIN0
N$14
  Top 0.254: R11.1 C14.1
N$15
  Top 0.254: R10.1 C13.1
N$16
  Top 0.254: R9.1 C12.1
N$17
  Top 0.254: U7.33 41.89,14.64 R15.2
N$18
  Top 0.254: F1.2 31.62,14.1 30.35,15.37 C5.A 21.84,15.37 21.34,15.88 21.34,17.2 IC1.3
N$20  (via drill 0.51)
  Top 0.254: SJ1.2 7.62,5.08 8.89,6.35 v15.24,6.35 | U8.6 37.12,8.61 v35.56,10.16
  Bottom 0.254: v15.24,6.35 26.67,6.35 30.48,10.16 v35.56,10.16
RIGHT
  Top 0.254: JP2.5 49.45,9.1 47.61,10.94 R9.2 47.61,13.73 45.97,15.37 45.97,18.16 45.56,18.57 U7.39
RX
  Top 0.254: U1.16 40.64,43.94 41.15,44.45 R20.2 43.8,45.07 44.45,45.72 45.72,45.72 46.99,44.45 R19.1
RX-I  (via drill 0.51)
  Top 0.254: R20.1 45.1,43.8 v46.99,41.91
  Bottom 0.254: JP3.3 46.99,38.1 v46.99,41.91
S0  (via drill 0.51)
  Top 0.254: U1.26 27.94,40.94 v26,39 | U3.10 20.05,39.76 v20,39.81
  Bottom 0.254: v26,39 20.81,39 v20,39.81
S1
  Top 0.254: U1.2 26.67,32.13 26.04,31.5 21.97,31.5 20.7,32.76 U3.11
S2
  Top 0.254: U1.27 26.67,41.91 25.4,40.64 24.13,40.64 23,41.77 23,43 22.69,43.31 21.08,43.31 20.7,42.93 U3.14
S3
  Top 0.254: U1.1 24.45,33.55 21.36,36.65 U3.13
SW1
  Top 0.254: U6.1 16.55,54.65 17.78,55.88 24.13,55.88 30.48,49.53 30.48,45.72 30.48,44.45 U1.24
SW2  (via drill 0.51)
  Top 0.254: U1.4 29.21,34.79 27,37 26,37 v25,38 | U6.T 19.05,50.95 v21,49
  Bottom 0.254: v25,38 27,38 28,39 28,43 22,49 v21,49
SW3
  Top 0.254: U6.2 21.55,52.11 29.21,44.45 U1.25
T1
  Top 0.254: R36.2 5.08,11.43 U10.18
T2
  Top 0.254: R35.2 5.08,13.97 U10.17
T3
  Top 0.254: R21.2 5.08,16.51 U10.16
T4
  Top 0.254: R22.2 5.08,19.05 U10.15
T5
  Top 0.254: R23.2 5.08,21.59 U10.14
T6
  Top 0.254: R24.2 5.08,24.13 U10.13
T7
  Top 0.254: R25.2 5.08,26.67 U10.12
T8
  Top 0.254: R26.2 5.08,29.21 U10.11
T9
  Top 0.254: R27.2 5.08,31.75 U10.10
T10
  Top 0.254: R28.2 5.08,34.29 U10.9
T11
  Top 0.254: R29.2 5.08,36.83 U10.8
T12
  Top 0.254: R30.2 5.08,39.37 U10.7
T13
  Top 0.254: R31.2 5.08,41.91 U10.6
T14
  Top 0.254: R32.2 5.08,44.45 U10.5
T15
  Top 0.254: R33.2 5.08,46.99 U10.4
T16
  Top 0.254: R34.2 5.08,49.53 U10.3
T17
  Top 0.254: U10.2 5.08,52.07 R37.2
T18
  Top 0.254: R38.2 5.08,54.61 U10.1
TRIG1
  Top 0.254: U3.9 19.41,29.57 15.24,25.4 15.24,16.38 10.29,11.43 R36.1
TRIG2
  Top 0.254: U3.8 18.75,29.8 14.48,25.53 14.48,17.65 10.79,13.97 R35.1
TRIG3
  Top 0.254: U3.7 18.11,30.04 13.72,25.65 13.72,18.8 11.43,16.51 R21.1
TRIG4
  Top 0.254: U3.6 17.45,30.41 12.83,25.78 12.83,21.21 10.67,19.05 R22.1
TRIG5
  Top 0.254: U3.5 16.8,30.77 11.94,25.91 11.94,22.73 10.79,21.59 R23.1
TRIG6
  Top 0.254: U3.4 16.16,31.14 11.05,26.04 11.05,24.89 10.29,24.13 R24.1
TRIG7
  Top 0.254: U3.3 15.51,32.02 10.16,26.67 R25.1
TRIG8
  Top 0.254: U3.2 14.86,32.63 11.43,29.21 R26.1
TRIG9  (via drill 0.51)
  Top 0.254: U3.23 14.86,40.26 13.97,39.37 v12.7,39.37 | R27.1 v11.43,31.75
  Bottom 0.254: v12.7,39.37 12.7,39.24 13.26,38.68 13.26,33.58 v11.43,31.75
TRIG10  (via drill 0.51)
  Top 0.254: U3.22 15.51,38.37 15.24,38.1 v12.27,38.1 | R28.1 v11.43,34.29
  Bottom 0.254: v12.27,38.1 12.27,35.13 v11.43,34.29
TRIG11
  Top 0.254: U3.21 16.16,37.74 15.24,36.83 R29.1
TRIG12
  Top 0.254: U3.20 16.8,42.99 16.43,43.36 11.2,43.36 10.39,42.55 10.39,39.7 10.06,39.37 R30.1
TRIG13
  Top 0.254: U3.19 17.45,43.25 16.82,43.89 10.87,43.89 9.54,42.56 R31.1
TRIG14
  Top 0.254: U3.18 18.11,44.12 17.78,44.45 R32.1
TRIG15
  Top 0.254: U3.17 18.75,44.74 16.51,46.99 R33.1
TRIG16
  Top 0.254: U3.16 19.41,46.63 16.51,49.53 R34.1
TRIG17  (via drill 0.51)
  Top 0.254: v29.21,40.64 27.56,38.99 27.56,37.21 28.19,36.58 35.18,36.58 35.56,36.96 35.56,38.86 36.32,39.62 37.72,39.62 39.24,38.1 JP9.5 41.91,40.64 U1.15 | R37.1 v11.43,52.07
  Bottom 0.254: v29.21,40.64 29.21,45.72 22.86,52.07 v11.43,52.07
TRIG18  (via drill 0.51)
  Top 0.254: v30.48,35.56 35.56,35.56 36.83,36.83 JP9.4 38.1,36.83 39.37,36.83 40.64,35.56 U1.13 | R38.1 v10.79,54.61
  Bottom 0.254: v30.48,35.56 30.48,48.26 24.13,54.61 v10.79,54.61
TX  (via drill 0.51)
  Top 0.254: v45.47,32 39.75,32 39.37,32.38 U1.12
  Bottom 0.254: JP3.2 48.26,29.21 v45.47,32
USBVCC
  Top 0.254: U8.5 40.64,5.08 41.91,3.81 41.91,2.54 43.18,1.27 45.72,1.27 46.99,2.54 46.99,3.81 48.26,5.08 50.8,5.08 55.88,10.16 55.88,33.02 54.61,34.29 JP3.4
VBUS
  Top 0.254: SJ1.3 8.51,1.65 9.27,0.89 30.61,0.89 31.46,1.75 U8.1 31.46,2.64 32.89,4.06 32.89,9.02 31.75,10.16 | 31.75,10.16 F1.1 | JP5.2 19.3,10.41 21.59,12.7 24.13,12.7 26.67,10.16 31.75,10.16
  Bottom 0.254: JP9.1 29.21,34.29 19.05,24.13 JP5.2
XRES
  Top 0.254: JP9.3 34.29,38.73 36.83,41.27 U1.19

### Text on the board
Bottom: 6-16-10
tPlace: TRIG18 | Power | TRIG17 | TRIG16 | MP3 Trigger | robertsonics | TRIG15 | TRIG14 | BLK | TRIG13 | GND | TRIG12 | TRIG11 | USBVCC | TRIG10 | RX | TRIG9 | TX | Status | TRIG8 | TRIG7 | GRN | TRIG6 | TRIG5 | TRIG4 | TRIG3 | TRIG2 | TRIG1 | USB | 3.3V | VBUS | EXT